# Altium schematic sheet Bank0_I_O.SchDoc
size A3
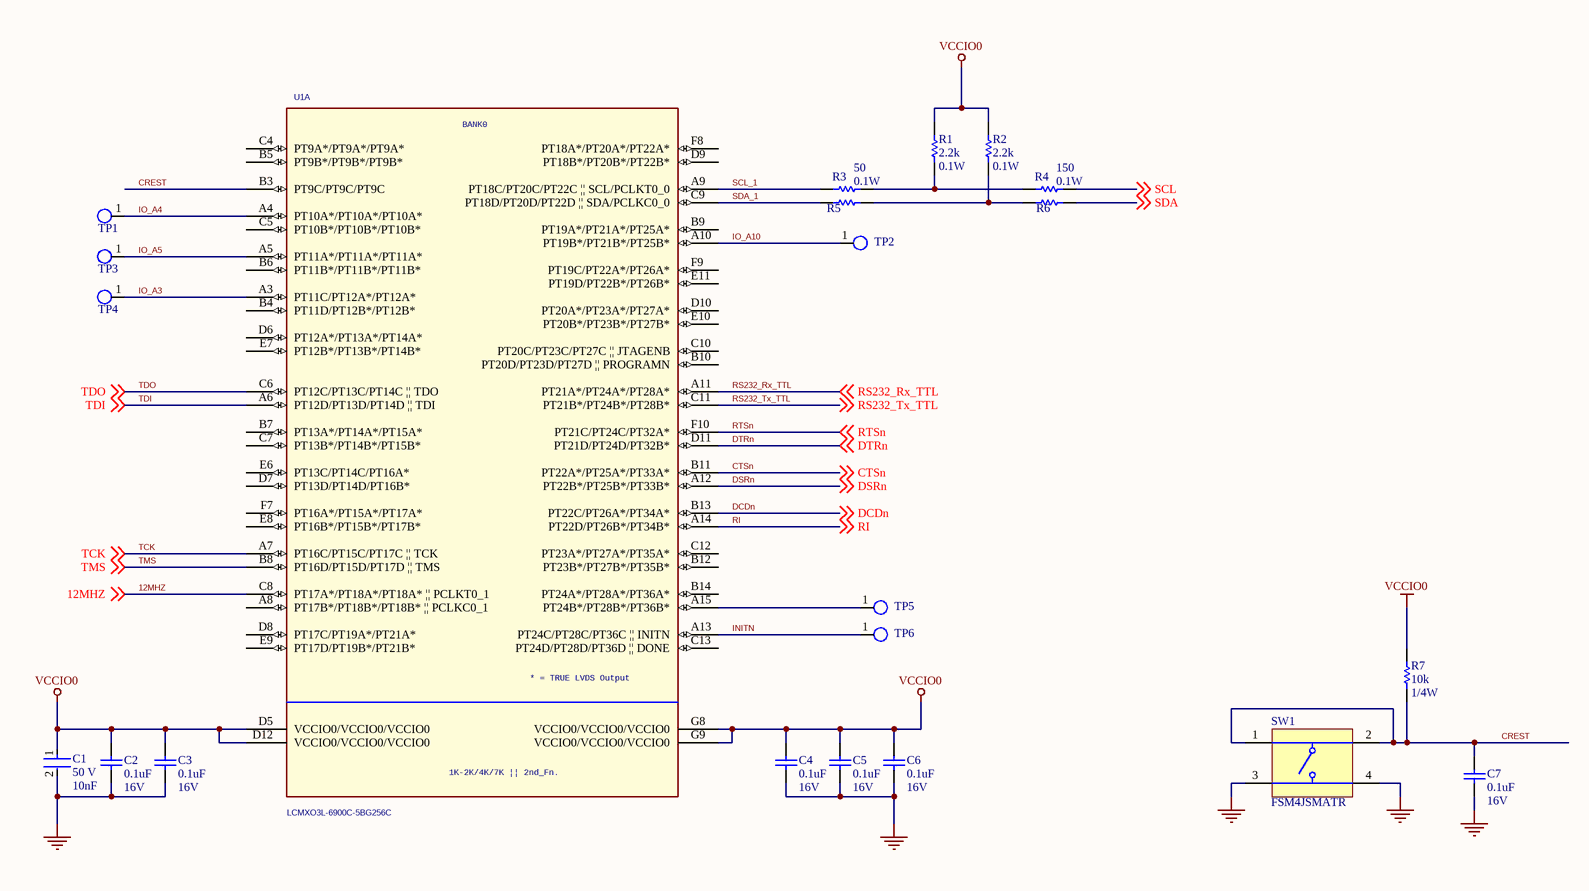
[diagram p0: Bank0_I_O.SchDoc]

## Parts
C1  value 10nF  Voltage: 50 V  [FP-C0805C-DN-MFG]  (hidden comment: C0805C103K5RACAUTO)
C2  value 0.1uF  Voltage: 16V  [CAPC1608X87X35ML15T15]  (hidden comment: C0603C104M4RACTU)
C3  value 0.1uF  Voltage: 16V  [CAPC1608X87X35ML15T15]  (hidden comment: C0603C104M4RACTU)
C4  value 0.1uF  Voltage: 16V  [CAPC1608X87X35ML15T15]  (hidden comment: C0603C104M4RACTU)
C5  value 0.1uF  Voltage: 16V  [CAPC1608X87X35ML15T15]  (hidden comment: C0603C104M4RACTU)
C6  value 0.1uF  Voltage: 16V  [CAPC1608X87X35ML15T15]  (hidden comment: C0603C104M4RACTU)
C7  value 0.1uF  Voltage: 16V  [CAPC1608X87X35ML15T15]  (hidden comment: C0603C104M4RACTU)
R1  value 2.2k  Power: 0.1W  [RESC1608X55X25LL10T15]  (hidden comment: RC0603FR-072K2L)
R2  value 2.2k  Power: 0.1W  [RESC1608X55X25LL10T15]  (hidden comment: RC0603FR-072K2L)
R3  value 50  Power: 0.1W  [RESC1609X50X30NL10T20]  (hidden comment: CRCW060350R0FKEA)
R4  value 150  Power: 0.1W  [RESC1608X55X30NL15T15]  (hidden comment: ERJ-3EKF1500V)
R5  CRCW060350R0FKEA  [RESC1609X50X30NL10T20]  (value not drawn)
R6  ERJ-3EKF1500V  [RESC1608X55X30NL15T15]  (value not drawn)
R7  value 10k  Power: 1/4W  [RESC3216X70X50NL05T20]  (hidden comment: ERJ-8GEYJ103V)
SW1  FSM4JSMATR  [TECO-FSM4JSMATR_V]
TP1  Test_Point_SMD  [Test_Point_SMD]  (value not drawn)
TP2  Test_Point_SMD  [Test_Point_SMD]  (value not drawn)
TP3  Test_Point_SMD  [Test_Point_SMD]  (value not drawn)
TP4  Test_Point_SMD  [Test_Point_SMD]  (value not drawn)
TP5  Test_Point_SMD  [Test_Point_SMD]  (value not drawn)
TP6  Test_Point_SMD  [Test_Point_SMD]  (value not drawn)
U1  LCMXO3L-6900C-5BG256C  [BGA256C80P16X16_1400X1400X170]  (part A of 7)

## Nets
GND: C1.2 C2.2 C3.2 C4.2 C5.2 C6.2 C7.2 SW1.3 SW1.4
VCCIO0: C1.1 C2.1 C3.1 C4.1 C5.1 C6.1 R1.2 R2.2 R7.1 U1.D5(VCCIO0/VCCIO0/VCCIO0) U1.D12(VCCIO0/VCCIO0/VCCIO0) U1.G8(VCCIO0/VCCIO0/VCCIO0) U1.G9(VCCIO0/VCCIO0/VCCIO0)
12MHZ: U1.C8(PT17A*/PT18A*/PT18A*_||_PCLKT0_1) ; off-sheet 12MHZ
CREST: C7.1 R7.2 SW1.1 SW1.2 U1.B3(PT9C/PT9C/PT9C)
CTSn: U1.B11(PT22A*/PT25A*/PT33A*) ; off-sheet CTSn
DCDn: U1.B13(PT22C/PT26A*/PT34A*) ; off-sheet DCDn
DSRn: U1.A12(PT22B*/PT25B*/PT33B*) ; off-sheet DSRn
DTRn: U1.D11(PT21D/PT24D/PT32B*) ; off-sheet DTRn
INITN: TP6.1(TP) U1.A13(PT24C/PT28C/PT36C_||_INITN)
IO_A3: TP4.1(TP) U1.A3(PT11C/PT12A*/PT12A*)
IO_A4: TP1.1(TP) U1.A4(PT10A*/PT10A*/PT10A*)
IO_A5: TP3.1(TP) U1.A5(PT11A*/PT11A*/PT11A*)
IO_A10: TP2.1(TP) U1.A10(PT19B*/PT21B*/PT25B*)
RI: U1.A14(PT22D/PT26B*/PT34B*) ; off-sheet RI
RS232_Rx_TTL: U1.A11(PT21A*/PT24A*/PT28A*) ; off-sheet RS232_Rx_TTL
RS232_Tx_TTL: U1.C11(PT21B*/PT24B*/PT28B*) ; off-sheet RS232_Tx_TTL
RTSn: U1.F10(PT21C/PT24C/PT32A*) ; off-sheet RTSn
SCL: R4.2 ; off-sheet SCL
SCL_1: R3.1 U1.A9(PT18C/PT20C/PT22C_||_SCL/PCLKT0_0)
SDA: R6.2 ; off-sheet SDA
SDA_1: R5.1 U1.C9(PT18D/PT20D/PT22D_||_SDA/PCLKC0_0)
TCK: U1.A7(PT16C/PT15C/PT17C_||_TCK) ; off-sheet TCK
TDI: U1.A6(PT12D/PT13D/PT14D_||_TDI) ; off-sheet TDI
TDO: U1.C6(PT12C/PT13C/PT14C_||_TDO) ; off-sheet TDO
TMS: U1.B8(PT16D/PT15D/PT17D_||_TMS) ; off-sheet TMS
NetR1_1: R1.1 R3.2 R4.1
NetR2_1: R2.1 R5.2 R6.1
NetTP5_1: TP5.1(TP) U1.A15(PT24B*/PT28B*/PT36B*)

Not connected (* = marked no-connect by the designer): U1 A8(PT17B*/PT18B*/PT18B*_||_PCLKC0_1) B4(PT11D/PT12B*/PT12B*) B5(PT9B*/PT9B*/PT9B*) B6(PT11B*/PT11B*/PT11B*) B7(PT13A*/PT14A*/PT15A*) B9(PT19A*/PT21A*/PT25A*) B10(PT20D/PT23D/PT27D_||_PROGRAMN) B12(PT23B*/PT27B*/PT35B*) B14(PT24A*/PT28A*/PT36A*) C4(PT9A*/PT9A*/PT9A*) C5(PT10B*/PT10B*/PT10B*) C7(PT13B*/PT14B*/PT15B*) C10(PT20C/PT23C/PT27C_||_JTAGENB) C12(PT23A*/PT27A*/PT35A*) C13(PT24D/PT28D/PT36D_||_DONE) D6(PT12A*/PT13A*/PT14A*) D7(PT13D/PT14D/PT16B*) D8(PT17C/PT19A*/PT21A*) D9(PT18B*/PT20B*/PT22B*) D10(PT20A*/PT23A*/PT27A*) E6(PT13C/PT14C/PT16A*) E7(PT12B*/PT13B*/PT14B*) E8(PT16B*/PT15B*/PT17B*) E9(PT17D/PT19B*/PT21B*) E10(PT20B*/PT23B*/PT27B*) E11(PT19D/PT22B*/PT26B*) F7(PT16A*/PT15A*/PT17A*) F8(PT18A*/PT20A*/PT22A*) F9(PT19C/PT22A*/PT26A*)

## Notes on the sheet
- Title
- Size:
- Date:
- A3
- Number:
- Time:
- Revision:
- Sheet
- of
- File:
- (in symbol LCMXO3L-1K/2K/4K/7K-BG256, part A) BANK0; * = TRUE LVDS Output; 1K-2K/4K/7K || 2nd_Fn.

## Library data of the parts
C1 = CMP-03020-006206-1: CAP CER 10000PF 50V X7R 0805; Manufacturer: KEMET; Material: Ceramic; Temperature Coefficient: 30ppm/°C; Alternative1: GRM21BR72A103KA01L Murata; Alternative2: C0805F103K5RACTU KEMET; Alternative3: 08055C103JAT2A Kyocera AVX; Height: 0.88mm; Temperature Characteristic: X7R; Part Number: C0805C103K5RACAUTO; ComponentLink2URL: https://content.kemet.com/datasheets/KEM_C1003_C0G_SMD.pdf; RoHS: TRUE; Temperature: -55°C to +125°C; Temperature Range Low: -55°C; ComponentLink2Description: Datasheet; Package / Case: C0805C-DN; Lead Free: Yes
C2-C7 = CMP-2006-03067-1: Ceramic Capacitor 0.1uF 16V +-10% X7R0603; Manufacturer: Kemet; Alternative1: C1608X7R1E104K TDK; Alternative2: CC0603KRX7R8BB104 Yageo; Alternative3: GRM188R72A104KA35D Murata; Part Number: C0603C104M4RACTU; Package / Case: 0603
R1 R2 = CMP-2000-06934-1: Thick Film Resistor, 2.2 KOhm, 100 mW, 50 V, +/- 1%, -55 to 155 degC, 2-Pin SMD (0603), RoHS, Tape and Reel; Manufacturer: Yageo; Temperature Coefficient: 100PPM/C; Voltage: 50V; Alternative1: RC0603FR-102K2L Yageo; Alternative2: RMCF0603FT2K20 Stackpole Electronics; Alternative3: CRCW06032K20FKEA Vishay; Tolerance: 1%; Datasheet Version: Rev. 7, 05/2017; Case Code - mm: 1608; Series: RC; Mounting Technology: SurfaceMount; Package Description: 2-Pin Surface Mount Device, Body 1.6 x 0.8 mm; Package / Case: 0603; Package Reference: 0603; Product: ThickFilmResistorsGeneralPurpose; Manufacturer URL: http://www.yageo.com/; Termination Style: SMD/SMT; Operating Temperature Range: -55Cto+155C; Datasheet URL: http://www.yageo.com/documents/recent/PYu-RC_Group_51_RoHS_L_7.pdf; Packaging: Reel
R3 = CMP-2000-03436-1: Manufacturer: Vishay Dale; Part Number: CRCW060350R0FKEA
R4 = CMP-2000-00256-1: Manufacturer: Panasonic; Part Number: ERJ-3EKF1500V
R5 = CMP-2000-03436-1: Manufacturer: Vishay Dale; Value: 50; Power: 0.1W; Part Number: CRCW060350R0FKEA
R6 = CMP-2000-00256-1: Manufacturer: Panasonic; Value: 150; Power: 0.1W; Part Number: ERJ-3EKF1500V
R7 = CMP-2003-00545-1: Res Thick Film 1206 10k Ohms 5% 1/4W; Manufacturer: Panasonic; Alternative1: CR1206F-10KFI TT Welwyn; Alternative2: WR12X1002FGL Walsin Technologies; Alternative3: CR1206-FX-1002ELF Bourns; Part Number: ERJ-8GEYJ103V; Package / Case: 1206
SW1 = CMP-2000-07486-1: Micro Miniature Push Button Switch FSM JSM, 50 mA, -35 to 85 degC, 4-Pin SMD, RoHS, Tape and Reel; Manufacturer: TE Connectivity; Mechanical Life: 100000Cycles; Current Rating: 50mA; Actuator Material: Polyamide; Max Voltage Rating (DC): 12V; Capacitance: 0f; Illumination Type: Illuminated; Voltage Rating (DC): 24V; Case\/Package: SMD/SMT; Operating Force: 160gf; Contact Resistance: 100mOhm; Actuator Length: 0.055inch; Switch Travel: 0.25mm; Throw Configuration: SPST; Termination: GullWing; Contact Plating: Silver; Orientation: Straight; Mounting Technology: SurfaceMount; REACH SVHC: Unknown; Electrical Life: 100000Cycles; Package Reference: FSM4JSMATR; Max Operating Temperature: 85degC; Manufacturer URL: http://www.te.com/; Package Description: 4-Pin Surface Mount Device, Body 6 x 6 mm, Pitch 4.5 mm; Datasheet Version: Rev. V, 02/2015; Packaging: TapeandReel; Min Operating Temperature: -35degC; Mount: SurfaceMount; Contact Current Rating: 50mA; Contact Material: CopperAlloy; Package Quantity: 1200; Datasheet URL: http://www.te.com/commerce/DocumentDelivery/DDEController?Action=showdoc&DocId=Customer+Drawing%7F2-1437565-7%7FV%7Fpdf%7FEnglish%7FENG_CD_2-1437565-7_V.pdf%7F4-1437565-2; RoHSCompliant: true
U1 = LCMXO3L-1K/2K/4K/7K-BG256: IC FPGA 6864LUTS 256BGA; Manufacturer: Lattice semi; SPLIT_INST: TRUE; SWAP_INFO: (S1+S2+S3+S4+S5+S6+S7); Manufacturer Part Number: LCMXO3L-6900C-5BG256C; Digikey P/N: 220-1886-ND